# EAGLE design LMP848x Breakout v1.3 (EAGLE 8.3.2)
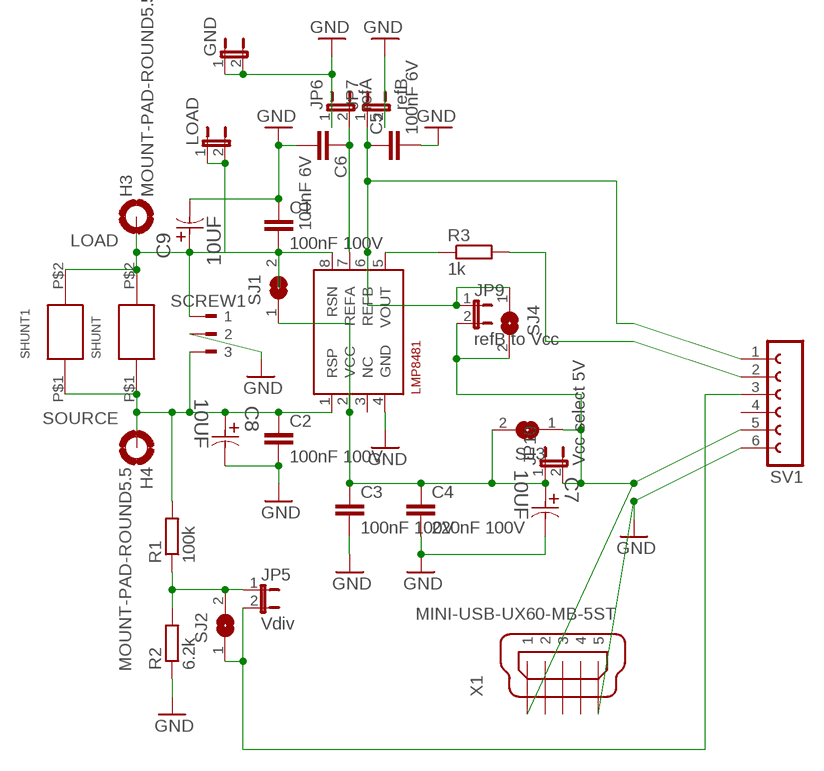
[diagram p0: schematic, sheet 1]

## Parts
C1  100nF 100V  C-EUC0805  [C0805]
C2  100nF 100V  C-EUC0805  [C0805]
C3  100nF 100V  C-EUC0805  [C0805]
C4  220nF 100V  C-EUC0805  [C0805]
C5  100nF 6V  C-EUC0805  [C0805]
C6  100nF 6V  C-EUC0805  [C0805]
C7  10UF  ECA1HM100I-D5XP2.5  [CAPPR250-500X1100]
C8  10UF  ECA1HM100I-D5XP2.5  [CAPPR250-500X1100]
C9  10UF  ECA1HM100I-D5XP2.5  [CAPPR250-500X1100]
GND  JP1E  [JP1]
H3  MOUNT-PAD-ROUND5.5  [5,5-PAD]
H4  MOUNT-PAD-ROUND5.5  [5,5-PAD]
JP5  Vdiv  JP1E  [JP1]
JP6  refA  JP1E  [JP1]
JP7  refB  JP1E  [JP1]
JP9  refB to Vcc  JP1E  [JP1]
JP10  Vcc select 5V  JP1E  [JP1]
LMP848X  LMP8481-H  [S-PDSO-G08]
LOAD  JP1E  [JP1]
R1  100k  R-EU_0207/7  [0207/7]
R2  6.2k  R-EU_0204/5  [0204/5]
R3  1k  R-EU_0204/5  [0204/5]
SCREW1  180-3  [180-3]
SHUNT  EBW_SERIES_15.2MM  [EBW_SERIES_15.2MM]
SHUNT1  EBW_SERIES_15.2MM  [EBW_SERIES_15.2MM]
SJ1  SJ  [SJ]
SJ2  SJ  [SJ]
SJ3  SJ  [SJ]
SJ4  SJ  [SJ]
SV1  FE06-1  [FE06]
X1  MINI-USB-UX60-MB-5ST  [UX60-MB-5ST]

## Nets
GND: C1.1 C2.2 C3.2 C4.2 C5.2 C6.2 C7.2 C8.2 C9.2 GND.1 GND.2 JP6.1 JP7.2 LMP848X.4(GND) R2.1 SCREW1.2 SV1.6 X1.5
LOAD: C1.2 C9.1 H3.B5,5(MOUNT) LMP848X.8(RSN) LOAD.1 LOAD.2 SCREW1.1 SHUNT1.P$2 SHUNT.P$2 SJ1.2
N$1: C3.1 C4.1 C7.1 JP10.1 LMP848X.2(VCC) SJ1.1 SJ3.2
N$2: LMP848X.5(VOUT) R3.1
N$3: C5.1 JP7.1 JP9.1 LMP848X.6(REFB) SJ4.1 SV1.1
N$4: JP9.2 JP10.2 SJ3.1 SJ4.2 SV1.5 X1.1
N$5: R3.2 SV1.2
N$6: C6.1 JP6.2 LMP848X.7(REFA)
N$7: JP5.1 R1.1 R2.2 SJ2.2
SOURCE: C2.1 C8.1 H4.B5,5(MOUNT) LMP848X.1(RSP) R1.2 SCREW1.3 SHUNT1.P$1 SHUNT.P$1
VDIV: JP5.2 SJ2.1 SV1.3
Unconnected: LMP848X.3(NC) SV1.4 X1.2 X1.3 X1.4

## Library data of the parts
C1-C6 = rcl:C-EU: CAPACITOR, European symbol
C7-C9 = Panasonic-ECA_00:ECA: Aluminum Electrolytic Capacitors/Radial Lead Type/Series: M/Type: A; MPN: ECA1HM100I; OC_FARNELL: 2282220; OC_NEWARK: 48W7714; PACKAGE: Radial Lead-TH; SUPPLIER: PANASONIC; TOLERANCE: ±20 %; VOLTAGERATING: 50V
GND JP5-JP7 JP9 JP10 LOAD = jumper:JP1E: JUMPER
H3 H4 = holes:MOUNT-PAD-ROUND: MOUNTING PAD, round
LMP848X = LMP8481:LMP8481: LMP8481MM-H/NOPB 100V/V
R1-R3 = rcl:R-EU_: RESISTOR, European symbol
SCREW1 = con-weidmueller-sl35:180-3: WEIDMUELLER CLAMP CONNECTOR; OC_FARNELL: unknown; OC_NEWARK: unknown
SHUNT SHUNT1 = EBW series shunt:EBW_SERIES_15.2MM
SJ1-SJ4 = jumper:SJ: SMD solder JUMPER
SV1 = con-lsta:FE06-1: FEMALE HEADER; OC_FARNELL: unknown; OC_NEWARK: unknown
X1 = con-hirose:MINI-USB-: MINI USB Connector Source: http://www.hirose.co.jp/cataloge_hp/e24000019.pdf; OC_FARNELL: unknown; OC_NEWARK: unknown

## Net classes
2 thin_power: width 0.254 mm

## Board
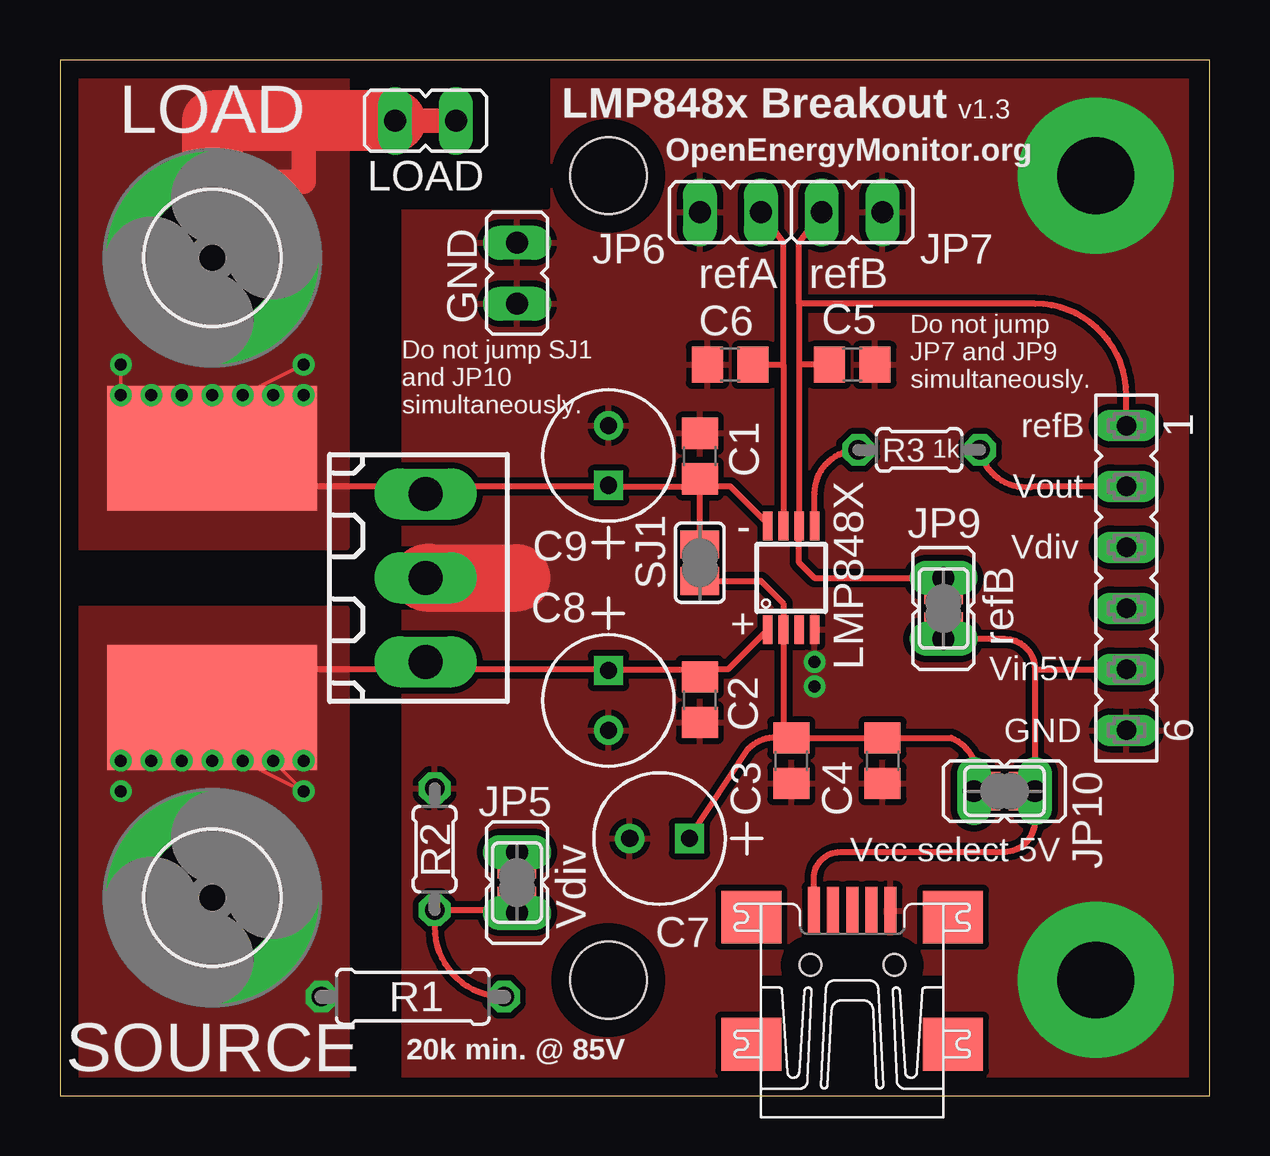
[diagram p1: board, top side]
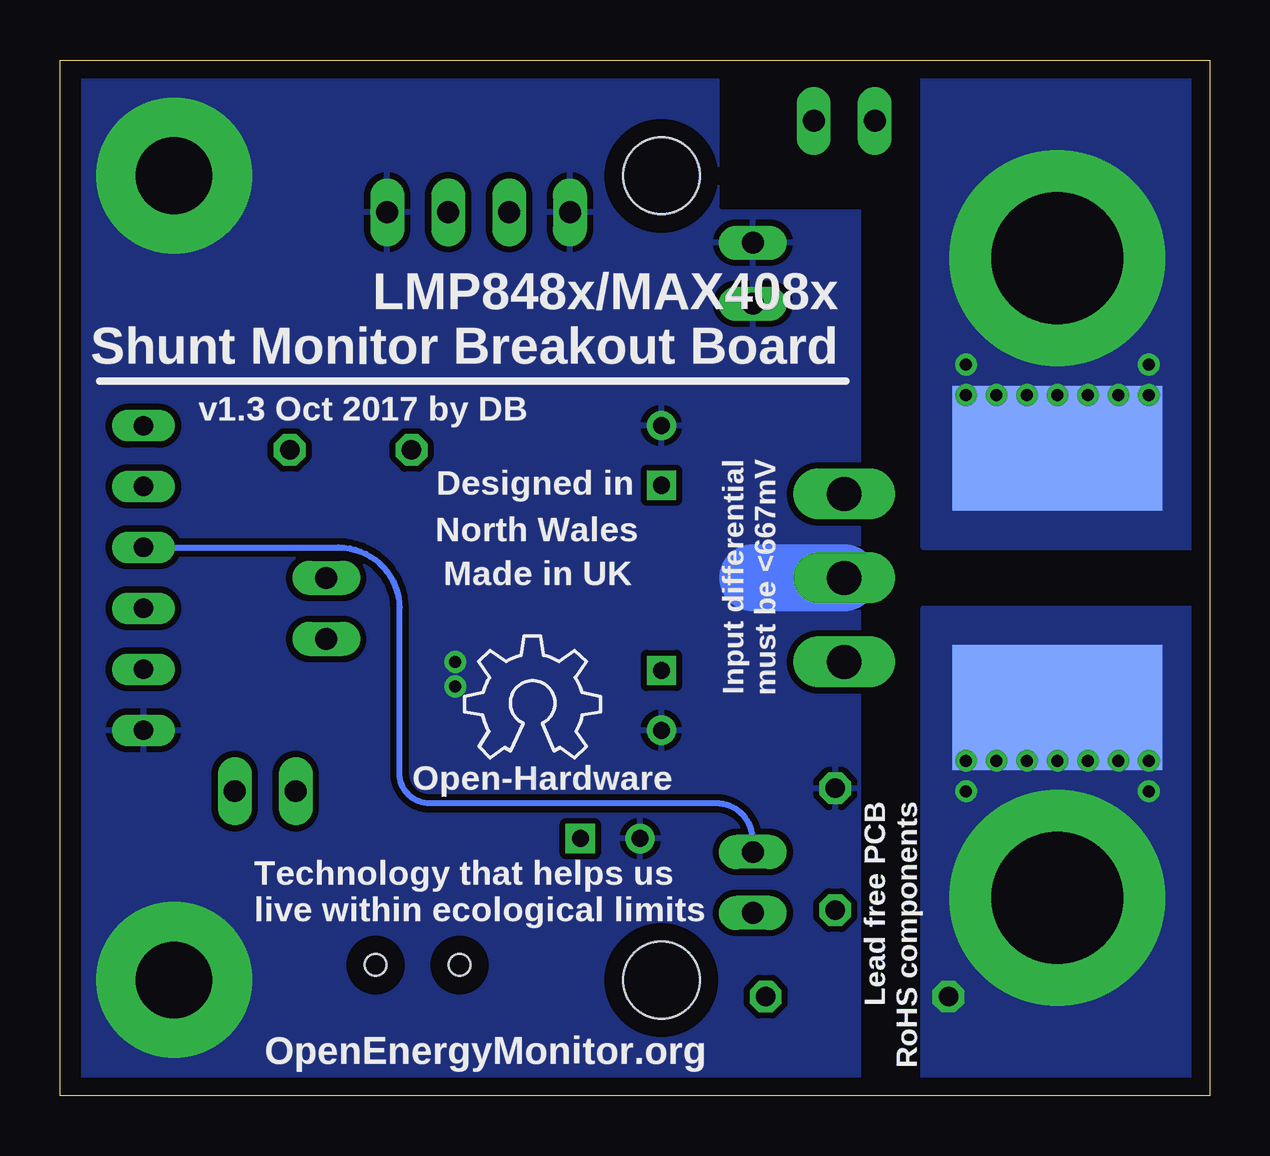
[diagram p2: board, bottom side, seen from below]

Size 47.93 x 43.17 mm. Coordinates in mm from the lower left corner, seen from the top.
Outline: 0,0 47.93,0 47.93,43.17 0,43.17 0,0
Copper layers (1*16): Top 0.035mm / dielectric 1.5mm / Bottom 0.035mm
Design rules "default *": minimum track width 10mil, minimum drill 0.5mm, track to track 10mil, track to pad 10mil, pad to pad 10mil, via to via 10mil, smd to smd 6mil, copper to edge 30mil, drill to drill 6mil, minimum pad ring 10mil, minimum via ring 8mil, stop-mask expansion 4mil, vias tented up to drill 0mil, thermal gap 10mil
Holes 3.2 mm at 22.86,38.35 22.86,4.83
tRestrict: area 14,37.1 to 20.3,42.4
bRestrict: area 14,37.1 to 20.3,42.4

### Footprints (pad centres in the part's own frame; a part is rotated, then mirrored left to right if it is on the bottom)
C0805 = smd 1.3 x 1.5: 1 -0.95,0; 2 0.95,0
CAPPR250-500X1100 = drill 0.711 square: 1 -2.489,0 | drill 0.711: 2 0,0
JP1 = drill 0.914 long: 1 0,-1.27; 2 0,1.27
5,5-PAD = drill 5.5 pad 9: B5,5 0,0
S-PDSO-G08 = smd 0.4 x 1.2: 1 -0.975,-2.157; 2 -0.325,-2.157; 3 0.325,-2.157; 4 0.975,-2.157; 5 0.975,2.157; 6 0.325,2.157; 7 -0.325,2.157; 8 -0.975,2.157
0207/7 = drill 0.813 octagon: 1 -3.81,0; 2 3.81,0
0204/5 = drill 0.813 octagon: 1 -2.54,0; 2 2.54,0
180-3 = drill 1.422 long: 1 -3.5,0; 2 0,0; 3 3.5,0
EBW_SERIES_15.2MM = smd 5.2 x 8.75: P$1 -5.4,0; P$2 5.4,0
SJ = smd 1.168 x 1.6: 1 -0.762,0; 2 0.762,0
FE06 = drill 0.813 long: 1 -6.35,0; 2 -3.81,0; 3 -1.27,0; 4 1.27,0; 5 3.81,0; 6 6.35,0
UX60-MB-5ST = smd 2 x 0.5: 1 2.25,1.6; 2 2.25,0.8; 3 2.25,0; 4 2.25,-0.8; 5 2.25,-1.6 | smd 2.2 x 2.5: M1 -3.3,-4.2; M2 -3.3,4.2; M3 2,4.2; M4 2,-4.2 | hole 0.9: 0,-1.75; 0,1.75

### Placement (x,y rotation side)
C1  26.67,26.67 270 top
C2  26.67,16.51 270 top
C3  30.48,13.97 270 top
C4  34.29,13.97 270 top
C5  33.02,30.48 0 top
C6  27.94,30.48 180 top
C7  23.75,10.72 180 top
C8  22.86,15.24 270 top
C9  22.86,27.94 90 top
GND  19.05,34.29 180 top
H3  6.35,34.92 0 top
H4  6.35,8.26 0 top
JP5  19.05,8.89 0 top
JP6  27.94,36.83 270 top
JP7  33.02,36.83 270 top
JP9  36.83,20.32 180 top
JP10  39.37,12.7 270 top
LMP848X  30.48,21.59 0 top
LOAD  15.24,40.64 90 top
LOGO1  OSHW_LOGO_6MILX0200-NT  [OSHW_6X200_NOTEXT]  31.07,14.09 0 bottom
R1  14.71,4.14 180 top
R2  15.62,10.28 270 top
R3  35.81,26.92 0 top
SCREW1  15.24,21.59 270 top
SHUNT  6.35,21.59 90 bottom
SHUNT1  6.35,21.59 90 top
SJ1  26.67,22.23 90 top
SJ2  19.05,8.89 270 top
SJ3  39.37,12.7 180 top
SJ4  36.83,20.32 270 top
SV1  44.45,21.59 270 top
X1  33.02,5.45 90 top

### Tracks (layer width: path | path; a pad name or v marks a point on that pad's centre or on a via)
GND  (via drill 0.5, 3.2 pad 6.5)
  Top 2.794: 15.37,21.62 15.39,21.59 SCREW1.2 19.05,21.59
  Bottom 2.794: 19.05,21.59 SCREW1.2 15.47,21.59
  other vias: 43.18,38.35 43.18,4.83 31.46,18.09 31.46,17.07
  pour Top: 14.3,43.21 46.99,43.18 46.99,0 14.3,0.03
  pour Bottom: 14.61,43.18 46.99,43.18 46.99,0 14.61,0
LOAD  (via drill 0.5)
  Top 0.152: v2.54,30.48 v2.54,29.21 3.49,26.99 SHUNT1.P$2 | SHUNT1.P$2 4.76,26.99 v3.81,29.21 | SHUNT1.P$2 6.03,26.99 v5.08,29.21 | SHUNT1.P$2 v6.35,29.21 | SHUNT1.P$2 9.21,26.99 v10.16,29.21 v8.89,29.21 7.94,26.99 SHUNT1.P$2 | SHUNT1.P$2 6.67,26.99 v7.62,29.21 v10.16,30.48
  Top 0.254: SHUNT1.P$2 7.94,25.4 15.24,25.4 SCREW1.1 16.51,25.4 22.86,25.4 | SJ1.2 26.67,25.4 | LMP848X.8 29.5,23.84 27.94,25.4 26.67,25.4 | 26.67,25.4 C1.2 | 22.86,25.4 26.67,25.4 | C9.1 22.86,25.4
  Top 1.016: 10.16,39.37 10.16,38.1 6.35,38.1 H3.B5,5 | LOAD.1 LOAD.2
  Top 2.54: LOAD.2 6.35,40.64 6.35,38.1
  pour Top (no thermals): 0,43.18 11.94,43.18 11.94,22.86 0,22.86
  pour Bottom (no thermals): 11.94,43.18 0,43.18 0,22.86 11.94,22.86
N$1
  Top 0.254: 30.16,14.92 C3.1 C4.1 37.15,14.92 arc-90 JP10.1 SJ3.2 | 30.16,14.92 LMP848X.2 30.16,20.52 29.21,21.46 SJ1.1 | 30.16,14.92 arc56 28.7,14.48 26.27,10.79 C7.1
N$2
  Top 0.254: 31.46,23.84 LMP848X.5 31.46,25.11 arc-90 R3.1
N$3
  Top 0.254: 30.81,30.48 LMP848X.6 30.81,22.23 31.44,21.59 JP9.1 SJ4.1 | 30.81,33.02 30.81,30.48 | 30.81,33.02 30.81,35.56 JP7.1 | C5.1 30.81,30.48 | 30.81,33.02 40.64,33.02 arc-90 44.45,29.21 SV1.1
N$4
  Top 0.254: JP10.2 40.64,11.6 arc-90 39.48,10.18 39.37,10.16 32.51,10.16 arc90 31.42,9.07 X1.1 | 40.64,17.78 SV1.5 | 40.64,17.78 JP10.2 | 40.64,17.78 arc90 39.37,19.05 JP9.2 SJ4.2 | JP10.2 SJ3.1
N$5
  Top 0.254: SV1.2 40.64,25.4 arc-90 R3.2
N$6
  Top 0.254: 30.16,30.48 30.16,35.56 JP6.2 | 30.16,30.48 LMP848X.7 | C6.1 30.16,30.48
N$7
  Top 0.254: SJ2.2 JP5.1 19.05,7.74 R2.2 15.62,7.04 arc90 R1.1
SOURCE  (via drill 0.5)
  Top 0.152: SHUNT1.P$1 3.49,16.19 v2.54,13.97 | SHUNT1.P$1 4.76,16.19 v3.81,13.97 | SHUNT1.P$1 6.03,16.19 v5.08,13.97 | SHUNT1.P$1 v6.35,13.97 | SHUNT1.P$1 9.21,16.19 v10.16,13.97 | SHUNT1.P$1 7.94,16.19 v8.89,13.97 v10.16,12.7 v7.62,13.97 6.67,16.19 SHUNT1.P$1
  Top 0.254: 6.35,17.78 15.24,17.78 SCREW1.3 arc90 16.82,17.78 22.86,17.78 | LMP848X.1 27.85,17.78 26.67,17.78 | C2.1 26.67,17.78 | 22.86,17.78 26.67,17.78 | C8.1 22.86,17.78
  other vias: 2.54,12.7
  pour Top (no thermals): 0,20.32 11.94,20.32 11.94,0 0,0
  pour Bottom (no thermals): 11.94,20.32 0,20.32 0,0 11.94,0
VDIV
  Top 0.254: JP5.2 SJ2.1
  Bottom 0.254: SV1.3 36.32,22.86 arc90 33.78,20.32 33.78,13.46 arc-90 32.51,12.19 20.57,12.19 arc90 19.05,10.67 JP5.2

### Text on the board
tPlace: v1.3 | Do not jump / JP7 and JP9 / simultaneously. | Do not jump SJ1 / and JP10 / simultaneously. | 1k | Vdiv | 20k min. @ 85V
bPlace: LMP848x/MAX408x / Shunt Monitor Breakout Board | v1.3 Oct 2017 by DB | Input differential / must be <667mV | Designed in | North Wales | Made in UK | Lead free PCB / RoHS components | Open-Hardware | Technology that helps us / live within ecological limits | OpenEnergyMonitor.org
tNames: LMP848x Breakout | LOAD | OpenEnergyMonitor.org | refA | refB | refB | Vout | Vdiv | SJ1 | refB | Vin5V | GND | Vcc select 5V | SOURCE
tValues: 47.93 | 43.17